# Altium schematic sheet _gyroscope.SchDoc
size Tabloid
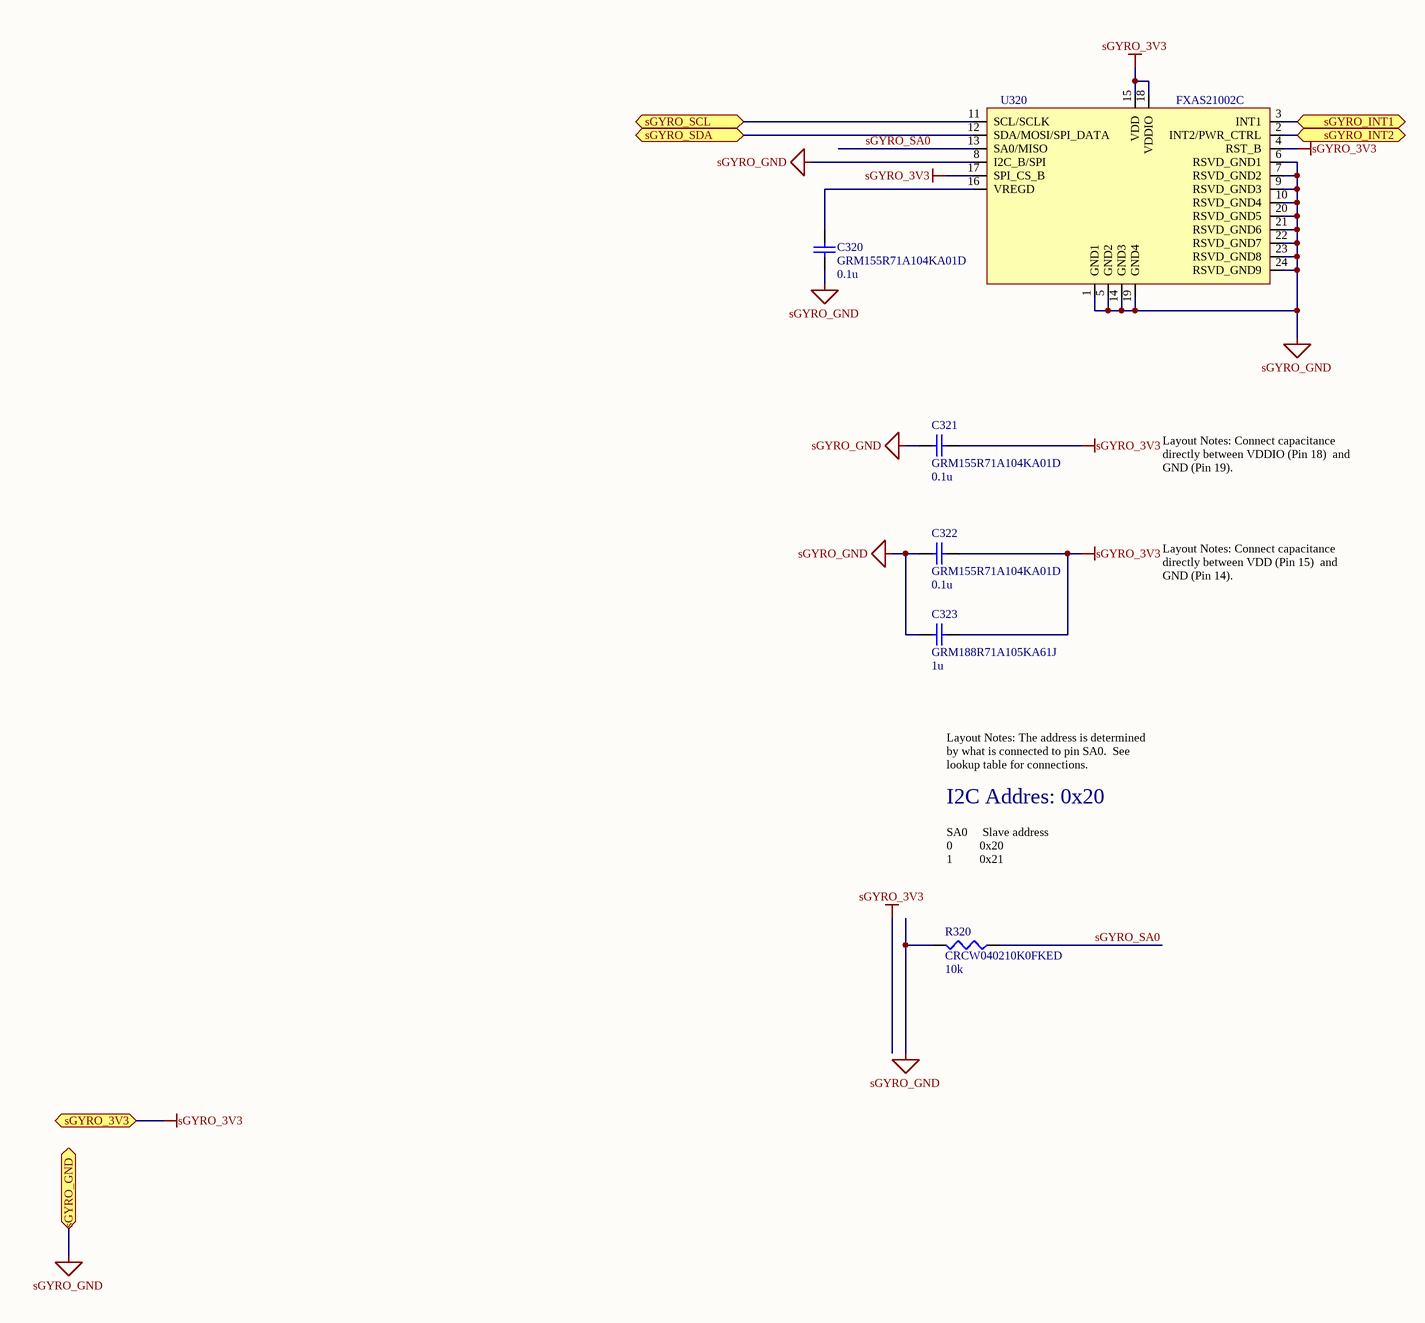
[diagram p0: _gyroscope.SchDoc]

## Parts
C320  GRM155R71A104KA01D  value 0.1u  [0402]
C321  GRM155R71A104KA01D  value 0.1u  [0402]
C322  GRM155R71A104KA01D  value 0.1u  [0402]
C323  GRM188R71A105KA61J  value 1u  [0603]
R320  CRCW040210K0FKED  value 10k  [0402]
U320  FXAS21002C  [SMD QFN 24_4X4MM 7/5]

## Ports
sGYRO_3V3, sGYRO_GND, sGYRO_INT1, sGYRO_INT2, sGYRO_SCL, sGYRO_SDA

## Nets
sGYRO_3V3: C321.2 C322.2 C323.1 U320.4(RST_B) U320.15(VDD) U320.17(SPI_CS_B) U320.18(VDDIO) ; port sGYRO_3V3
sGYRO_GND: C320.2 C321.1 C322.1 C323.2 R320.2 U320.1(GND1) U320.5(GND2) U320.6(RSVD_GND1) U320.7(RSVD_GND2) U320.8(I2C_B/SPI) U320.9(RSVD_GND3) U320.10(RSVD_GND4) U320.14(GND3) U320.19(GND4) U320.20(RSVD_GND5) U320.21(RSVD_GND6) U320.22(RSVD_GND7) U320.23(RSVD_GND8) U320.24(RSVD_GND9) ; port sGYRO_GND
sGYRO_INT1: U320.3(INT1) ; port sGYRO_INT1
sGYRO_INT2: U320.2(INT2/PWR_CTRL) ; port sGYRO_INT2
sGYRO_SA0: R320.1 U320.13(SA0/MISO)
sGYRO_SCL: U320.11(SCL/SCLK) ; port sGYRO_SCL
sGYRO_SDA: U320.12(SDA/MOSI/SPI_DATA) ; port sGYRO_SDA
NetC320_1: C320.1 U320.16(VREGD)

## Notes on the sheet
- Layout Notes: Connect capacitance directly between VDDIO (Pin 18)  and GND (Pin 19).
- Layout Notes: Connect capacitance directly between VDD (Pin 15)  and GND (Pin 14).
- Layout Notes: The address is determined by what is connected to pin SA0.  See lookup table for connections.
- I2C Addres: 0x20
- SA0     Slave address
  0         0x20
  1         0x21

## Library data of the parts
C320-C322 = GRM155R71AxxxKdddd: -55-125C, 1005, 10V, X7R, ±10%
C323 = GRM188R71AxxxKdddd: -55-125C, 1608, 10V, X7R, ±10%
R320 = CRCW0402xxxxFKED: 0.125W, -55-155C, 1005, 50V, ±1%
U320 = FXAS21002C: 3-Axis Digital Angular Rate  Gyroscope